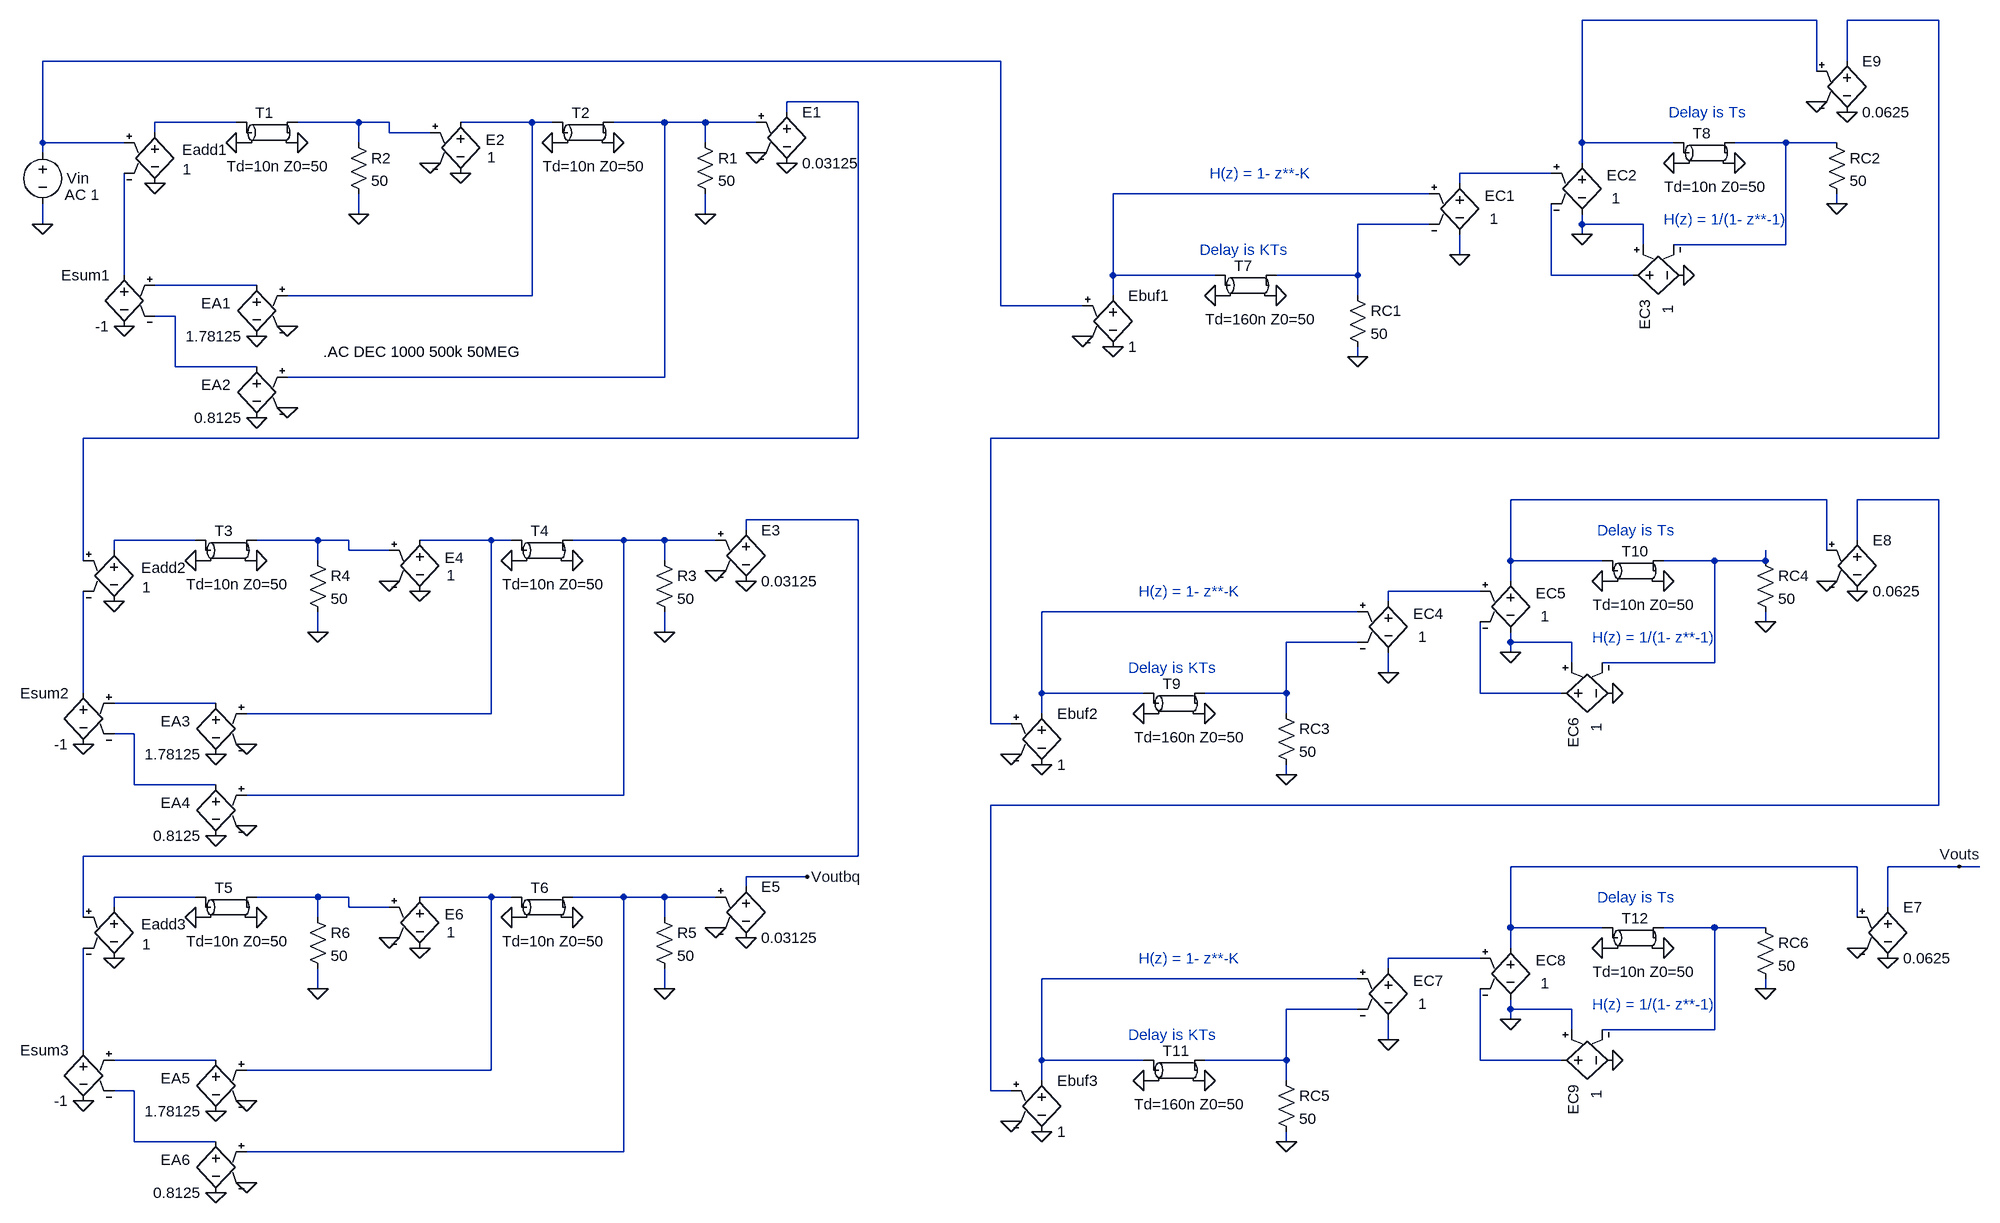
[diagram p0: schematic _Fig4_54_MSD.asc]
_Fig4_54_MSD.asc, the LTspice schematic file:
Version 4
SHEET 1 3572 968
WIRE 3296 -896 2928 -896
WIRE 3488 -896 3344 -896
WIRE 2016 -832 512 -832
WIRE 3344 -832 3344 -896
WIRE 3296 -816 3296 -896
WIRE 1792 -768 1680 -768
WIRE 1680 -752 1680 -768
WIRE 816 -736 688 -736
WIRE 1008 -736 912 -736
WIRE 1056 -736 1008 -736
WIRE 1280 -736 1168 -736
WIRE 1312 -736 1280 -736
WIRE 1488 -736 1408 -736
WIRE 1552 -736 1488 -736
WIRE 1632 -736 1552 -736
WIRE 688 -720 688 -736
WIRE 1056 -720 1056 -736
WIRE 1120 -720 1056 -720
WIRE 512 -704 512 -832
WIRE 640 -704 512 -704
WIRE 1008 -704 1008 -736
WIRE 1552 -704 1552 -736
WIRE 2928 -704 2928 -896
WIRE 3072 -704 2928 -704
WIRE 3248 -704 3168 -704
WIRE 3328 -704 3248 -704
WIRE 512 -688 512 -704
WIRE 2928 -672 2928 -704
WIRE 2880 -656 2736 -656
WIRE 2736 -640 2736 -656
WIRE 2688 -624 2192 -624
WIRE 3328 -608 3328 -624
WIRE 1008 -592 1008 -624
WIRE 1552 -592 1552 -624
WIRE 512 -576 512 -608
WIRE 2688 -576 2576 -576
WIRE 2928 -576 2928 -592
WIRE 3024 -576 2928 -576
WIRE 2928 -560 2928 -576
WIRE 3024 -544 3024 -576
WIRE 3248 -544 3248 -704
WIRE 3248 -544 3072 -544
WIRE 2736 -528 2736 -560
WIRE 640 -496 640 -656
WIRE 2192 -496 2192 -624
WIRE 2352 -496 2192 -496
WIRE 2576 -496 2576 -576
WIRE 2576 -496 2448 -496
WIRE 2880 -496 2880 -608
WIRE 3008 -496 2880 -496
WIRE 848 -480 688 -480
WIRE 1280 -464 1280 -736
WIRE 1280 -464 896 -464
WIRE 2192 -464 2192 -496
WIRE 2576 -464 2576 -496
WIRE 2016 -448 2016 -832
WIRE 2144 -448 2016 -448
WIRE 720 -432 688 -432
WIRE 2576 -368 2576 -384
WIRE 720 -352 720 -432
WIRE 848 -352 720 -352
WIRE 1488 -336 1488 -736
WIRE 1488 -336 896 -336
WIRE 1792 -240 1792 -768
WIRE 1792 -240 576 -240
WIRE 3488 -240 3488 -896
WIRE 3488 -240 2000 -240
WIRE 3312 -144 2816 -144
WIRE 3488 -144 3360 -144
WIRE 1792 -112 1616 -112
WIRE 1616 -96 1616 -112
WIRE 752 -80 624 -80
WIRE 944 -80 848 -80
WIRE 992 -80 944 -80
WIRE 1216 -80 1104 -80
WIRE 1248 -80 1216 -80
WIRE 1424 -80 1344 -80
WIRE 1488 -80 1424 -80
WIRE 1568 -80 1488 -80
WIRE 3360 -80 3360 -144
WIRE 624 -64 624 -80
WIRE 992 -64 992 -80
WIRE 1056 -64 992 -64
WIRE 3312 -64 3312 -144
WIRE 576 -48 576 -240
WIRE 944 -48 944 -80
WIRE 1488 -48 1488 -80
WIRE 2816 -48 2816 -144
WIRE 2960 -48 2816 -48
WIRE 3136 -48 3056 -48
WIRE 3216 -48 3216 -64
WIRE 3216 -48 3136 -48
WIRE 2816 -16 2816 -48
WIRE 2768 0 2624 0
WIRE 2624 16 2624 0
WIRE 2576 32 2080 32
WIRE 3216 48 3216 32
WIRE 944 64 944 32
WIRE 1488 64 1488 32
WIRE 2576 80 2464 80
WIRE 2816 80 2816 64
WIRE 2912 80 2816 80
WIRE 2816 96 2816 80
WIRE 2912 112 2912 80
WIRE 3136 112 3136 -48
WIRE 3136 112 2960 112
WIRE 2624 128 2624 96
WIRE 576 160 576 0
WIRE 2080 160 2080 32
WIRE 2240 160 2080 160
WIRE 2464 160 2464 80
WIRE 2464 160 2336 160
WIRE 2768 160 2768 48
WIRE 2896 160 2768 160
WIRE 784 176 624 176
WIRE 1216 192 1216 -80
WIRE 1216 192 832 192
WIRE 2080 192 2080 160
WIRE 2464 192 2464 160
WIRE 2000 208 2000 -240
WIRE 2032 208 2000 208
WIRE 656 224 624 224
WIRE 2464 288 2464 272
WIRE 656 304 656 224
WIRE 784 304 656 304
WIRE 1424 320 1424 -80
WIRE 1424 320 832 320
WIRE 3488 336 3488 -144
WIRE 3488 336 2000 336
WIRE 1792 416 1792 -112
WIRE 1792 416 576 416
WIRE 3360 432 2816 432
WIRE 3520 432 3408 432
WIRE 3552 432 3520 432
WIRE 1712 448 1616 448
WIRE 1616 464 1616 448
WIRE 752 480 624 480
WIRE 944 480 848 480
WIRE 992 480 944 480
WIRE 1216 480 1104 480
WIRE 1248 480 1216 480
WIRE 1424 480 1344 480
WIRE 1488 480 1424 480
WIRE 1568 480 1488 480
WIRE 624 496 624 480
WIRE 992 496 992 480
WIRE 1056 496 992 496
WIRE 3408 496 3408 432
WIRE 576 512 576 416
WIRE 944 512 944 480
WIRE 1488 512 1488 480
WIRE 3360 512 3360 432
WIRE 2816 528 2816 432
WIRE 2960 528 2816 528
WIRE 3136 528 3056 528
WIRE 3216 528 3136 528
WIRE 2816 560 2816 528
WIRE 2768 576 2624 576
WIRE 2624 592 2624 576
WIRE 2576 608 2080 608
WIRE 944 624 944 592
WIRE 1488 624 1488 592
WIRE 3216 624 3216 608
WIRE 2576 656 2464 656
WIRE 2816 656 2816 640
WIRE 2912 656 2816 656
WIRE 2816 672 2816 656
WIRE 2912 688 2912 656
WIRE 3136 688 3136 528
WIRE 3136 688 2960 688
WIRE 2624 704 2624 672
WIRE 576 720 576 560
WIRE 784 736 624 736
WIRE 2080 736 2080 608
WIRE 2240 736 2080 736
WIRE 2464 736 2464 656
WIRE 2464 736 2336 736
WIRE 2768 736 2768 624
WIRE 2896 736 2768 736
WIRE 1216 752 1216 480
WIRE 1216 752 832 752
WIRE 2080 768 2080 736
WIRE 2464 768 2464 736
WIRE 656 784 624 784
WIRE 2000 784 2000 336
WIRE 2032 784 2000 784
WIRE 656 864 656 784
WIRE 784 864 656 864
WIRE 2464 864 2464 848
WIRE 1424 880 1424 480
WIRE 1424 880 832 880
FLAG 912 -704 0
FLAG 816 -704 0
FLAG 688 -640 0
FLAG 512 -576 0
FLAG 1552 -592 0
FLAG 1408 -704 0
FLAG 1312 -704 0
FLAG 640 -416 0
FLAG 848 -400 0
FLAG 896 -416 0
FLAG 848 -272 0
FLAG 896 -288 0
FLAG 1632 -688 0
FLAG 1680 -672 0
FLAG 1008 -592 0
FLAG 1168 -656 0
FLAG 1120 -672 0
FLAG 848 -48 0
FLAG 752 -48 0
FLAG 624 16 0
FLAG 1488 64 0
FLAG 1344 -48 0
FLAG 1248 -48 0
FLAG 576 240 0
FLAG 784 256 0
FLAG 832 240 0
FLAG 784 384 0
FLAG 832 368 0
FLAG 1568 -32 0
FLAG 1616 -16 0
FLAG 944 64 0
FLAG 1104 0 0
FLAG 1056 -16 0
FLAG 848 512 0
FLAG 752 512 0
FLAG 624 576 0
FLAG 1712 448 Voutbq
FLAG 1488 624 0
FLAG 1344 512 0
FLAG 1248 512 0
FLAG 576 800 0
FLAG 784 816 0
FLAG 832 800 0
FLAG 784 944 0
FLAG 832 928 0
FLAG 1568 528 0
FLAG 1616 544 0
FLAG 944 624 0
FLAG 1104 560 0
FLAG 1056 544 0
FLAG 2448 -464 0
FLAG 2352 -464 0
FLAG 2144 -400 0
FLAG 2192 -384 0
FLAG 2576 -368 0
FLAG 2736 -528 0
FLAG 2928 -560 0
FLAG 3168 -672 0
FLAG 3072 -672 0
FLAG 3328 -608 0
FLAG 3088 -496 0
FLAG 2336 192 0
FLAG 2240 192 0
FLAG 2032 256 0
FLAG 2080 272 0
FLAG 2464 288 0
FLAG 2624 128 0
FLAG 2816 96 0
FLAG 3056 -16 0
FLAG 2960 -16 0
FLAG 3216 48 0
FLAG 2976 160 0
FLAG 3360 560 0
FLAG 3408 576 0
FLAG 3520 432 Vouts
FLAG 2336 768 0
FLAG 2240 768 0
FLAG 2032 832 0
FLAG 2080 848 0
FLAG 2464 864 0
FLAG 2624 704 0
FLAG 2816 672 0
FLAG 3056 560 0
FLAG 2960 560 0
FLAG 3216 624 0
FLAG 2976 736 0
FLAG 3312 -16 0
FLAG 3360 0 0
FLAG 3296 -768 0
FLAG 3344 -752 0
SYMBOL tline 864 -720 R0
WINDOW 0 -18 -31 Left 0
WINDOW 3 -63 53 Left 0
SYMATTR InstName T1
SYMATTR Value Td=10n Z0=50
SYMBOL e 688 -736 R0
WINDOW 0 43 43 Left 0
WINDOW 3 44 74 Left 0
SYMATTR InstName Eadd1
SYMATTR Value 1
SYMBOL voltage 512 -704 R0
WINDOW 0 38 56 Left 0
WINDOW 123 35 82 Left 0
WINDOW 39 0 0 Left 0
SYMATTR InstName Vin
SYMATTR Value2 AC 1
SYMATTR Value ""
SYMBOL res 1536 -720 R0
SYMATTR InstName R1
SYMATTR Value 50
SYMBOL tline 1360 -720 R0
WINDOW 0 -18 -31 Left 0
WINDOW 3 -63 53 Left 0
SYMATTR InstName T2
SYMATTR Value Td=10n Z0=50
SYMBOL e 640 -512 M0
SYMATTR InstName Esum1
SYMATTR Value -1
SYMBOL e 848 -496 M0
WINDOW 0 42 44 Left 0
SYMATTR InstName EA1
SYMATTR Value 1.78125
SYMBOL e 848 -368 M0
WINDOW 0 42 44 Left 0
SYMATTR InstName EA2
SYMATTR Value 0.8125
SYMBOL e 1680 -768 R0
SYMATTR InstName E1
SYMATTR Value 0.03125
SYMBOL res 992 -720 R0
SYMATTR InstName R2
SYMATTR Value 50
SYMBOL e 1168 -752 R0
WINDOW 0 39 43 Left 0
WINDOW 3 42 71 Left 0
SYMATTR InstName E2
SYMATTR Value 1
SYMBOL tline 800 -64 R0
WINDOW 0 -18 -31 Left 0
WINDOW 3 -63 53 Left 0
SYMATTR InstName T3
SYMATTR Value Td=10n Z0=50
SYMBOL e 624 -80 R0
WINDOW 0 43 43 Left 0
WINDOW 3 44 74 Left 0
SYMATTR InstName Eadd2
SYMATTR Value 1
SYMBOL res 1472 -64 R0
SYMATTR InstName R3
SYMATTR Value 50
SYMBOL tline 1296 -64 R0
WINDOW 0 -18 -31 Left 0
WINDOW 3 -63 53 Left 0
SYMATTR InstName T4
SYMATTR Value Td=10n Z0=50
SYMBOL e 576 144 M0
SYMATTR InstName Esum2
SYMATTR Value -1
SYMBOL e 784 160 M0
WINDOW 0 42 44 Left 0
SYMATTR InstName EA3
SYMATTR Value 1.78125
SYMBOL e 784 288 M0
WINDOW 0 42 44 Left 0
SYMATTR InstName EA4
SYMATTR Value 0.8125
SYMBOL e 1616 -112 R0
SYMATTR InstName E3
SYMATTR Value 0.03125
SYMBOL res 928 -64 R0
SYMATTR InstName R4
SYMATTR Value 50
SYMBOL e 1104 -96 R0
WINDOW 0 39 43 Left 0
WINDOW 3 42 71 Left 0
SYMATTR InstName E4
SYMATTR Value 1
SYMBOL tline 800 496 R0
WINDOW 0 -18 -31 Left 0
WINDOW 3 -63 53 Left 0
SYMATTR InstName T5
SYMATTR Value Td=10n Z0=50
SYMBOL e 624 480 R0
WINDOW 0 43 43 Left 0
WINDOW 3 44 74 Left 0
SYMATTR InstName Eadd3
SYMATTR Value 1
SYMBOL res 1472 496 R0
SYMATTR InstName R5
SYMATTR Value 50
SYMBOL tline 1296 496 R0
WINDOW 0 -18 -31 Left 0
WINDOW 3 -63 53 Left 0
SYMATTR InstName T6
SYMATTR Value Td=10n Z0=50
SYMBOL e 576 704 M0
SYMATTR InstName Esum3
SYMATTR Value -1
SYMBOL e 784 720 M0
WINDOW 0 42 44 Left 0
SYMATTR InstName EA5
SYMATTR Value 1.78125
SYMBOL e 784 848 M0
WINDOW 0 42 44 Left 0
SYMATTR InstName EA6
SYMATTR Value 0.8125
SYMBOL e 1616 448 R0
SYMATTR InstName E5
SYMATTR Value 0.03125
SYMBOL res 928 496 R0
SYMATTR InstName R6
SYMATTR Value 50
SYMBOL e 1104 464 R0
WINDOW 0 39 43 Left 0
WINDOW 3 42 71 Left 0
SYMATTR InstName E6
SYMATTR Value 1
SYMBOL tline 2400 -480 R0
WINDOW 0 -18 -31 Left 0
WINDOW 3 -63 53 Left 0
SYMATTR InstName T7
SYMATTR Value Td=160n Z0=50
SYMBOL e 2192 -480 R0
SYMATTR InstName Ebuf1
SYMATTR Value 1
SYMBOL res 2560 -480 R0
SYMATTR InstName RC1
SYMATTR Value 50
SYMBOL e 2736 -656 R0
WINDOW 0 39 35 Left 0
WINDOW 3 47 71 Left 0
SYMATTR InstName EC1
SYMATTR Value 1
SYMBOL e 2928 -688 R0
WINDOW 0 39 35 Left 0
WINDOW 3 47 71 Left 0
SYMATTR InstName EC2
SYMATTR Value 1
SYMBOL e 2992 -496 M90
WINDOW 0 39 35 Left 0
WINDOW 3 47 71 Left 0
SYMATTR InstName EC3
SYMATTR Value 1
SYMBOL tline 3120 -688 R0
WINDOW 0 -18 -31 Left 0
WINDOW 3 -63 53 Left 0
SYMATTR InstName T8
SYMATTR Value Td=10n Z0=50
SYMBOL res 3312 -720 R0
SYMATTR InstName RC2
SYMATTR Value 50
SYMBOL tline 2288 176 R0
WINDOW 0 -18 -31 Left 0
WINDOW 3 -63 53 Left 0
SYMATTR InstName T9
SYMATTR Value Td=160n Z0=50
SYMBOL e 2080 176 R0
SYMATTR InstName Ebuf2
SYMATTR Value 1
SYMBOL res 2448 176 R0
SYMATTR InstName RC3
SYMATTR Value 50
SYMBOL e 2624 0 R0
WINDOW 0 39 35 Left 0
WINDOW 3 47 71 Left 0
SYMATTR InstName EC4
SYMATTR Value 1
SYMBOL e 2816 -32 R0
WINDOW 0 39 35 Left 0
WINDOW 3 47 71 Left 0
SYMATTR InstName EC5
SYMATTR Value 1
SYMBOL e 2880 160 M90
WINDOW 0 39 35 Left 0
WINDOW 3 47 71 Left 0
SYMATTR InstName EC6
SYMATTR Value 1
SYMBOL tline 3008 -32 R0
WINDOW 0 -18 -31 Left 0
WINDOW 3 -63 53 Left 0
SYMATTR InstName T10
SYMATTR Value Td=10n Z0=50
SYMBOL res 3200 -64 R0
SYMATTR InstName RC4
SYMATTR Value 50
SYMBOL e 3408 480 R0
SYMATTR InstName E7
SYMATTR Value 0.0625
SYMBOL tline 2288 752 R0
WINDOW 0 -18 -31 Left 0
WINDOW 3 -63 53 Left 0
SYMATTR InstName T11
SYMATTR Value Td=160n Z0=50
SYMBOL e 2080 752 R0
SYMATTR InstName Ebuf3
SYMATTR Value 1
SYMBOL res 2448 752 R0
SYMATTR InstName RC5
SYMATTR Value 50
SYMBOL e 2624 576 R0
WINDOW 0 39 35 Left 0
WINDOW 3 47 71 Left 0
SYMATTR InstName EC7
SYMATTR Value 1
SYMBOL e 2816 544 R0
WINDOW 0 39 35 Left 0
WINDOW 3 47 71 Left 0
SYMATTR InstName EC8
SYMATTR Value 1
SYMBOL e 2880 736 M90
WINDOW 0 39 35 Left 0
WINDOW 3 47 71 Left 0
SYMATTR InstName EC9
SYMATTR Value 1
SYMBOL tline 3008 544 R0
WINDOW 0 -18 -31 Left 0
WINDOW 3 -63 53 Left 0
SYMATTR InstName T12
SYMATTR Value Td=10n Z0=50
SYMBOL res 3200 512 R0
SYMATTR InstName RC6
SYMATTR Value 50
SYMBOL e 3360 -96 R0
SYMATTR InstName E8
SYMATTR Value 0.0625
SYMBOL e 3344 -848 R0
SYMATTR InstName E9
SYMATTR Value 0.0625
TEXT 952 -376 Left 0 !.AC DEC 1000 500k 50MEG
TEXT 2344 -656 Left 0 ;H(z) = 1- z**-K
TEXT 2328 -536 Left 0 ;Delay is KTs
TEXT 3064 -752 Left 0 ;Delay is Ts
TEXT 3056 -584 Left 0 ;H(z) = 1/(1- z**-1)
TEXT 2232 0 Left 0 ;H(z) = 1- z**-K
TEXT 2216 120 Left 0 ;Delay is KTs
TEXT 2952 -96 Left 0 ;Delay is Ts
TEXT 2944 72 Left 0 ;H(z) = 1/(1- z**-1)
TEXT 2232 576 Left 0 ;H(z) = 1- z**-K
TEXT 2216 696 Left 0 ;Delay is KTs
TEXT 2952 480 Left 0 ;Delay is Ts
TEXT 2944 648 Left 0 ;H(z) = 1/(1- z**-1)

The netlist it stands for:
* _Fig4_54_MSD.asc
T1 N005 0 N006 0 Td=10n Z0=50
Eadd1 N005 0 N003 N013 1
Vin N003 0 AC 1
R1 N008 0 50
T2 N007 0 N008 0 Td=10n Z0=50
Esum1 N013 0 N015 N016 -1
EA1 N015 0 N007 0 1.78125
EA2 N016 0 N008 0 0.8125
E1 N004 0 N008 0 0.03125
R2 N006 0 50
E2 N007 0 N006 0 1
T3 N020 0 N021 0 Td=10n Z0=50
Eadd2 N020 0 N004 N028 1
R3 N023 0 50
T4 N022 0 N023 0 Td=10n Z0=50
Esum2 N028 0 N030 N031 -1
EA3 N030 0 N022 0 1.78125
EA4 N031 0 N023 0 0.8125
E3 N019 0 N023 0 0.03125
R4 N021 0 50
E4 N022 0 N021 0 1
T5 N033 0 N034 0 Td=10n Z0=50
Eadd3 N033 0 N019 N041 1
R5 N036 0 50
T6 N035 0 N036 0 Td=10n Z0=50
Esum3 N041 0 N042 N044 -1
EA5 N042 0 N035 0 1.78125
EA6 N044 0 N036 0 0.8125
E5 Voutbq 0 N036 0 0.03125
R6 N034 0 50
E6 N035 0 N034 0 1
T7 N011 0 N012 0 Td=160n Z0=50
Ebuf1 N011 0 N003 0 1
RC1 N012 0 50
EC1 N010 0 N011 N012 1
EC2 N001 0 N010 N014 1
EC3 N014 0 0 N009 1
T8 N001 0 N009 0 Td=10n Z0=50
RC2 N009 0 50
T9 N026 0 N027 0 Td=160n Z0=50
Ebuf2 N026 0 N002 0 1
RC3 N027 0 50
EC4 N025 0 N026 N027 1
EC5 N017 0 N025 N029 1
EC6 N029 0 0 N024 1
T10 N017 0 N024 0 Td=10n Z0=50
RC4 N024 0 50
E7 Vouts 0 N032 0 0.0625
T11 N039 0 N040 0 Td=160n Z0=50
Ebuf3 N039 0 N018 0 1
RC5 N040 0 50
EC7 N038 0 N039 N040 1
EC8 N032 0 N038 N043 1
EC9 N043 0 0 N037 1
T12 N032 0 N037 0 Td=10n Z0=50
RC6 N037 0 50
E8 N018 0 N017 0 0.0625
E9 N002 0 N001 0 0.0625
.AC DEC 1000 500k 50MEG
* H(z) = 1- z**-K
* Delay is KTs
* Delay is Ts
* H(z) = 1/(1- z**-1)
* H(z) = 1- z**-K
* Delay is KTs
* Delay is Ts
* H(z) = 1/(1- z**-1)
* H(z) = 1- z**-K
* Delay is KTs
* Delay is Ts
* H(z) = 1/(1- z**-1)
.backanno
.end